# Altium schematic sheet E-11 SYS PWR.SchDoc: FRDM-IMX93
size 513 x 386 mm; DrawnBy: FORLINX; Organization: ORGANIZATION; Address1: ADDRESS 1; Address2: ADDRESS 2; Address3: ADDRESS 3; Address4: ADDRESS 4; Revision: -; ENG_APP_DATE: --/--/--; DSN_APP_DATE: --/--/--; CHK_APP_DATE: --/--/--; Classification: Public, Company Internal/Proprietary, Company Confidential,  Company Secret; Page Create Date: March  8, 1995; OrgName: NXP Semiconductor; FIUO: A; OrgAddr1: NO. 192 Liangjing Rd. Pudong New Area, ShangHai; Page Number: 11; PageTitle: SYS PWR; Page Size: C; Page Count: 23; Designer: FORLINX; RevCode: B1; Approver: NXP SE; Doc: SCH-94611 PDF: SPF-94611; DsnPath: T:\FILES\Designs\Single Board Computers\i.MX93-FRDM\Design Files\SCH-94611_B1.DSN; SchematicName: FRDM-i.MX 93 Development Board; PageName: E-11 SYS PWR; PageSize: C; TopSchematic: True
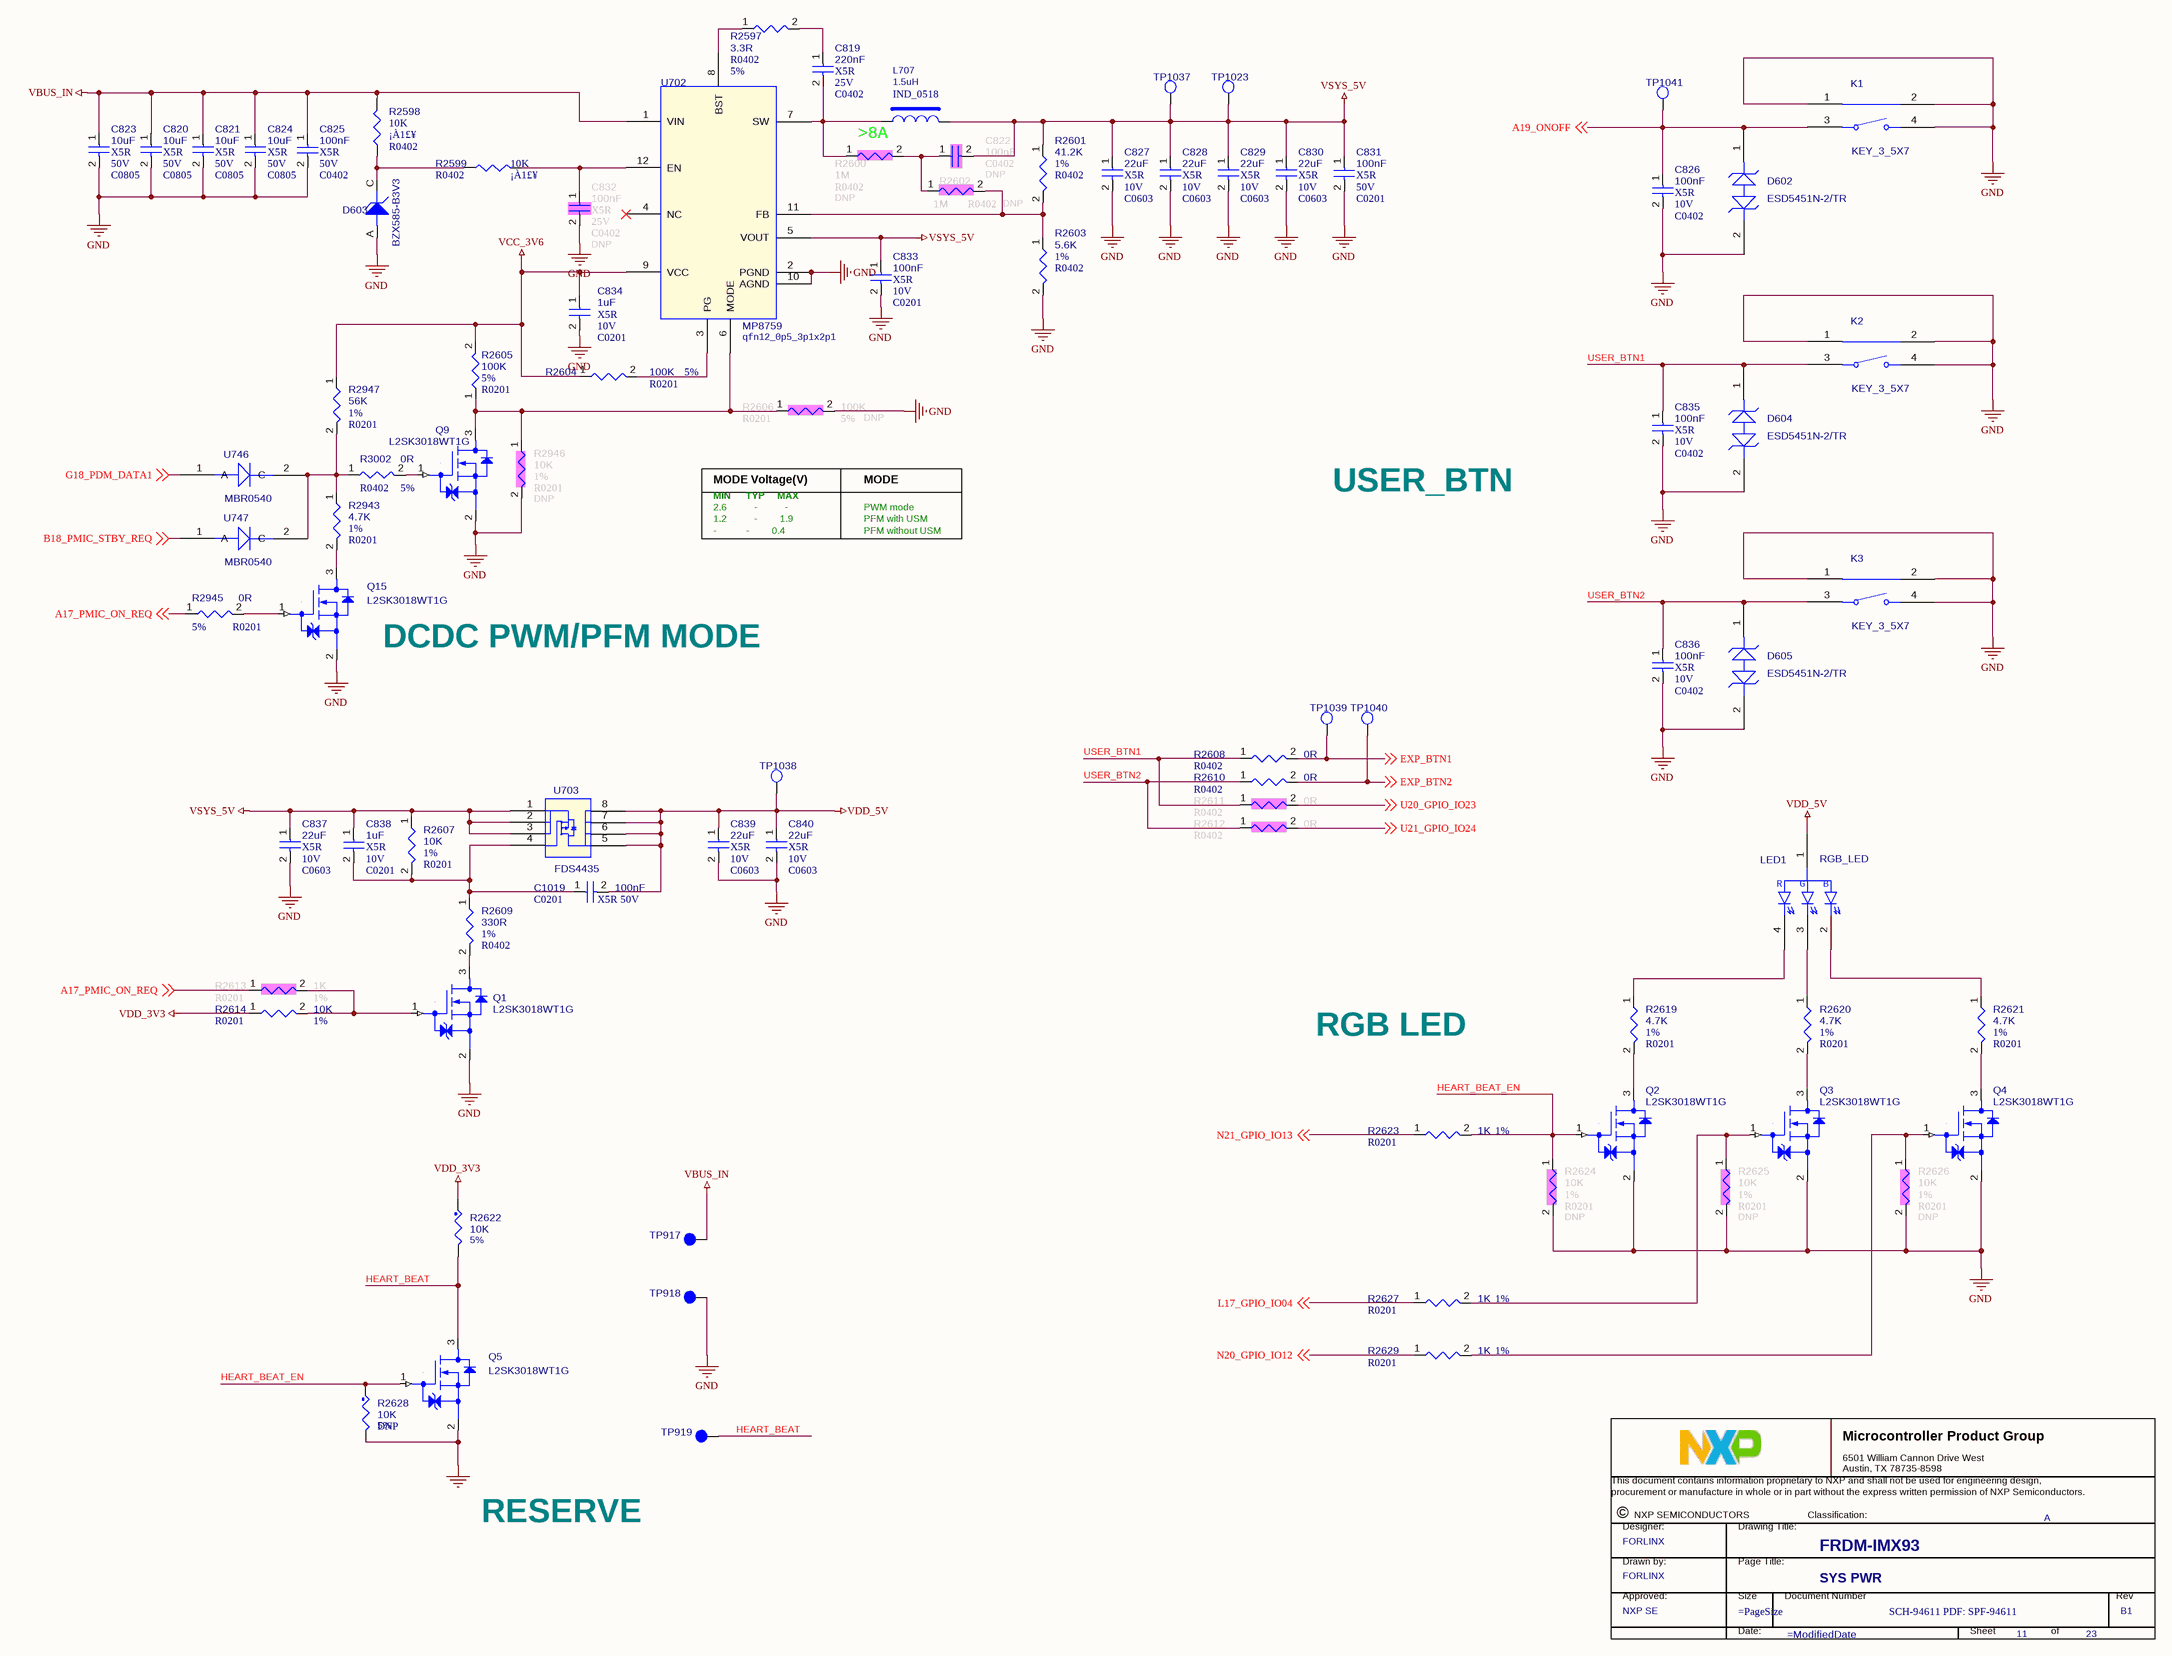
[diagram p0: E-11 SYS PWR.SchDoc]

## Parts
*  Title: FRDM-IMX93  RevCode: B1  PageTitle: SYS PWR  Page Number: 11  Page Count: 23  DrawnBy: FORLINX  Doc: SCH-94611 PDF: SPF-94611  Approver: NXP SE  FIUO: A  (graphical)
C819  220nF  Voltage: 25V  Dielectric: X5R  [C0402]
C820  10uF  Voltage: 50V  Dielectric: X5R  [C0805]
C821  10uF  Voltage: 50V  Dielectric: X5R  [C0805]
C822  100nF  ASSY_OPT: DNP  [C0402]
C823  10uF  Voltage: 50V  Dielectric: X5R  [C0805]
C824  10uF  Voltage: 50V  Dielectric: X5R  [C0805]
C825  100nF  Voltage: 50V  Dielectric: X5R  [C0402]
C826  100nF  Voltage: 10V  Dielectric: X5R  [C0402]
C827  22uF  Voltage: 10V  Dielectric: X5R  [C0603]
C828  22uF  Voltage: 10V  Dielectric: X5R  [C0603]
C829  22uF  Voltage: 10V  Dielectric: X5R  [C0603]
C830  22uF  Voltage: 10V  Dielectric: X5R  [C0603]
C831  100nF  Voltage: 50V  Dielectric: X5R  [C0201]
C832  100nF  Voltage: 25V  Dielectric: X5R  ASSY_OPT: DNP  [C0402]
C833  100nF  Voltage: 10V  Dielectric: X5R  [C0201]
C834  1uF  Voltage: 10V  Dielectric: X5R  [C0201]
C835  100nF  Voltage: 10V  Dielectric: X5R  [C0402]
C836  100nF  Voltage: 10V  Dielectric: X5R  [C0402]
C837  22uF  Voltage: 10V  Dielectric: X5R  [C0603]
C838  1uF  Voltage: 10V  Dielectric: X5R  [C0201]
C839  22uF  Voltage: 10V  Dielectric: X5R  [C0603]
C840  22uF  Voltage: 10V  Dielectric: X5R  [C0603]
C1019  100nF  Voltage: 50V  Dielectric: X5R  [C0201]
D602  ESD5451N-2/TR  [0402TVS]
D603  BZX585-B3V3  [sod523]
D604  ESD5451N-2/TR  [0402TVS]
D605  ESD5451N-2/TR  [0402TVS]
K1  KEY_3_5X7  [KEY_3_5X7]
K2  KEY_3_5X7  [KEY_3_5X7]
K3  KEY_3_5X7  [KEY_3_5X7]
L707  1.5uH  Option: >8A  [IND_0518]
LED1  RGB_LED  [smd_rgb_1_5x3]
Q1  L2SK3018WT1G  [sc70_3]
Q2  L2SK3018WT1G  [sc70_3]
Q3  L2SK3018WT1G  [sc70_3]
Q4  L2SK3018WT1G  [sc70_3]
Q5  L2SK3018WT1G  [sc70_3]
Q9  L2SK3018WT1G  [sc70_3]
Q15  L2SK3018WT1G  [sc70_3]
R2597  3.3R  Tolerance: 5%  [R0402]
R2598  10K  precision: ¡À1£¥  [R0402]
R2599  10K  precision: ¡À1£¥  [R0402]
R2600  1M  ASSY_OPT: DNP  [R0402]
R2601  41.2K  Tolerance: 1%  [R0402]
R2602  1M  ASSY_OPT: DNP  [R0402]
R2603  5.6K  Tolerance: 1%  [R0402]
R2604  100K  Tolerance: 5%  [R0201]
R2605  100K  Tolerance: 5%  [R0201]
R2606  100K  Tolerance: 5%  ASSY_OPT: DNP  [R0201]
R2607  10K  Tolerance: 1%  [R0201]
R2608  0R  [R0402]
R2609  330R  Tolerance: 1%  [R0402]
R2610  0R  [R0402]
R2611  0R  [R0402]
R2612  0R  [R0402]
R2613  1K  Tolerance: 1%  [R0201]
R2614  10K  Tolerance: 1%  [R0201]
R2619  4.7K  Tolerance: 1%  [R0201]
R2620  4.7K  Tolerance: 1%  [R0201]
R2621  4.7K  Tolerance: 1%  [R0201]
R2622  10K  Tolerance: 5%  [R0201]
R2623  1K  Tolerance: 1%  [R0201]
R2624  10K  Tolerance: 1%  ASSY_OPT: DNP  [R0201]
R2625  10K  Tolerance: 1%  ASSY_OPT: DNP  [R0201]
R2626  10K  Tolerance: 1%  ASSY_OPT: DNP  [R0201]
R2627  1K  Tolerance: 1%  [R0201]
R2628  10K  ASSY_OPT: DNP  Tolerance: 5%  [R0201]
R2629  1K  Tolerance: 1%  [R0201]
R2943  4.7K  Tolerance: 1%  [R0201]
R2945  0R  Tolerance: 5%  [R0201]
R2946  10K  Tolerance: 1%  ASSY_OPT: DNP  [R0201]
R2947  56K  Tolerance: 1%  [R0201]
R3002  0R  Tolerance: 5%  [R0402]
TP917  TPAD_1212  [tpad_1212]  (value not drawn)
TP918  TPAD_1212  [tpad_1212]  (value not drawn)
TP919  TPAD_1212  [tpad_1212]  (value not drawn)
TP1023  TPAD_020  [tpad_020]  (value not drawn)
TP1037  TPAD_020  [tpad_020]  (value not drawn)
TP1038  TPAD_020  [tpad_020]  (value not drawn)
TP1039  TPAD_020  [tpad_020]  (value not drawn)
TP1040  TPAD_020  [tpad_020]  (value not drawn)
TP1041  TPAD_020  [tpad_020]  (value not drawn)
U702  MP8759  [qfn12_0p5_3p1x2p1]
U703  FDS4435  [SOP8_1_27]
U746  MBR0540  [SOD_123]
U747  MBR0540  [SOD_123]

## Nets
GND: C820.2 C821.2 C823.2 C824.2 C825.2 C826.2 C827.2 C828.2 C829.2 C830.2 C831.2 C832.2 C833.2 C834.2 C835.2 C836.2 C837.2 C839.2 C840.2 D602.2 D603.A(ANODE) D604.2 D605.2 K1.1 K1.2 K1.4 K2.1 K2.2 K2.4 K3.1 K3.2 K3.4 Q1.2(SOURCE) Q2.2(SOURCE) Q3.2(SOURCE) Q4.2(SOURCE) Q5.2(SOURCE) Q9.2(SOURCE) Q15.2(SOURCE) R2603.2 R2606.2 R2624.2 R2625.2 R2626.2 R2628.2 R2946.2 TP918.1(Pin1) U702.2(PGND) U702.10(AGND)
VBUS_IN: C820.1 C821.1 C823.1 C824.1 C825.1 R2598.2 TP917.1(Pin1) U702.1(VIN)
VCC_3V6: C834.1 R2604.1 R2605.2 R2947.1 U702.9(VCC)
VDD_3V3: R2614.1 R2622.1
VDD_5V: C839.1 C840.1 C1019.2 LED1.1(+) TP1038.1(TP) U703.5(D4) U703.6(D3) U703.7(D2) U703.8(D1)
VSYS_5V: C822.2 C827.1 C828.1 C829.1 C830.1 C831.1 C833.1 C837.1 C838.1 L707.2 R2601.1 R2607.1 TP1023.1(TP) TP1037.1(TP) U702.5(VOUT) U703.1(S1) U703.2(S2) U703.3(S3)
A17_PMIC_ON_REQ: R2613.1 R2945.1 ; off-sheet A17_PMIC_ON_REQ
A19_ONOFF: C826.1 D602.1 K1.3 TP1041.1(TP) ; off-sheet A19_ONOFF
B18_PMIC_STBY_REQ: U747.1(A) ; off-sheet B18_PMIC_STBY_REQ
EXP_BTN1: R2608.2 TP1039.1(TP) ; off-sheet EXP_BTN1
EXP_BTN2: R2610.2 TP1040.1(TP) ; off-sheet EXP_BTN2
G18_PDM_DATA1: U746.1(A) ; off-sheet G18_PDM_DATA1
HEART_BEAT: Q5.3(DRAIN) R2622.2 TP919.1(Pin1)
HEART_BEAT_EN: Q2.1(GATE) Q5.1(GATE) R2623.2 R2624.1 R2628.1
L17_GPIO_IO04: R2627.1 ; off-sheet L17_GPIO_IO04
N20_GPIO_IO12: R2629.1 ; off-sheet N20_GPIO_IO12
N21_GPIO_IO13: R2623.1 ; off-sheet N21_GPIO_IO13
U20_GPIO_IO23: R2611.2 ; off-sheet U20_GPIO_IO23
U21_GPIO_IO24: R2612.2 ; off-sheet U21_GPIO_IO24
USER_BTN1: C835.1 D604.1 K2.3 R2608.1 R2611.1
USER_BTN2: C836.1 D605.1 K3.3 R2610.1 R2612.1
NetC819_1: C819.1 R2597.2
NetC819_2: C819.2 L707.1 R2600.1 U702.7(SW)
NetC822_1: C822.1 R2600.2 R2602.1
NetC832_1: C832.1 R2599.2 U702.12(EN)
NetC838_2: C838.2 C1019.1 R2607.2 R2609.1 U703.4(G)
NetD603_C: D603.C(CATHODE) R2598.1 R2599.1
NetLED1_2: LED1.2(B) R2621.1
NetLED1_3: LED1.3(G) R2620.1
NetLED1_4: LED1.4(R) R2619.1
NetQ1_1: Q1.1(GATE) R2613.2 R2614.2
NetQ1_3: Q1.3(DRAIN) R2609.2
NetQ2_3: Q2.3(DRAIN) R2619.2
NetQ3_1: Q3.1(GATE) R2625.1 R2627.2
NetQ3_3: Q3.3(DRAIN) R2620.2
NetQ4_1: Q4.1(GATE) R2626.1 R2629.2
NetQ4_3: Q4.3(DRAIN) R2621.2
NetQ9_1: Q9.1(GATE) R3002.2
NetQ9_3: Q9.3(DRAIN) R2605.1 R2606.1 R2946.1 U702.6(MODE)
NetQ15_1: Q15.1(GATE) R2945.2
NetQ15_3: Q15.3(DRAIN) R2943.2
NetR2597_1: R2597.1 U702.8(BST)
NetR2601_2: R2601.2 R2602.2 R2603.1 U702.11(FB)
NetR2604_2: R2604.2 U702.3(PG)
NetR2943_1: R2943.1 R2947.2 R3002.1 U746.2(C) U747.2(C)

Not connected (* = marked no-connect by the designer): U702 4(NC)*

## Notes on the sheet
- 2.6           -           -
- MIN      TYP     MAX
- MODE Voltage(V)
- PWM mode
- MODE
- USER_BTN
- -            -         0.4
- 1.2           -         1.9
- PFM without USM
- PFM with USM
- DCDC PWM/PFM MODE
- RGB LED
- RESERVE
- DWG. NO.
- REV.
- SHT.
- REVISION
- DESCRIPTION
- DATE
- APPROVED
- ENG:
- APPROVALS
- quilter.ai <http://quilter.ai>
- DSN:
- CHK:
- REFERENCE DOCUMENTS
- TITLE
- PROJECT
- BOM:
- FAB DWG:
- PCB DWG:
- ASSY DWG:
- SIZE
- FILE NAME
- C
- DWG NO.
- SHEET
- OF
- REV
- (in symbol TitleBlock_MCPG) Microcontroller Product Group; 6501 William Cannon Drive West / Austin, TX 78735-8598; This document contains information proprietary to NXP and shall not be used for engineering design,; procurement or manufacture in whole or in part without the express written permission of NXP Semiconductors.; ©; NXP SEMICONDUCTORS; Classification:; Designer:; Drawing Title:; Drawn by:; Page Title:; Approved:; Size; Document Number; Rev; Date:; Sheet; of

## Library data of the parts
* = TitleBlock_MCPG: Classification: Public, Company Internal/Proprietary, Company Confidential,  Company Secret; OrgAddr1: NO. 192 Liangjing Rd. Pudong New Area, ShangHai; OrgName: NXP Semiconductor; Page Size: =PageSize; Page Create Date: March  8, 1995; Designer: FORLINX; Page Modify Date: =ModifiedDate
C819 = CAP NP: 0402,220nF,25V,+/-10%,X5R; Part Reference: C819; Manufacturer PN: C1005X5R1E224K050BC; Manufacturer: TDK; MFG_NAME01: SAMSUNG; C_Voltage: 6.3V; Tolerance: 10%; Priority: A; Number: 37; MFG_PN01: CL05A224KA5NNNC; PCB Footprint: C0402; Value: 220nF; Created by: JJJ; Part Type: C0402; RK PN: C1005X5R1E224K050BC
C820 = CAP NP: 0805,10uF,50V,+/-10%,X5R; Part Reference: C820; Manufacturer PN: C2012X5R1A226K125AB; Manufacturer: TDK; MFG_NAME01: SAMSUNG; Tolerance: 10%; C_Voltage: 6.3V; Priority: A; MFG_PN01: CL21A106KBYQNNE; PCB Footprint: C0805; Value: 10uF; Created by: JJJ; Part Type: C0805; RK PN: C2012X5R1A226K125AB
C821 = CAP NP: 0805,10uF,50V,+/-10%,X5R; Part Reference: C821; Manufacturer: TDK; MFG_NAME01: SAMSUNG; RK PN: C2012X5R1A226K125AB; Priority: A; C_Voltage: 6.3V; Tolerance: 10%; MFG_PN01: CL21A106KBYQNNE; PCB Footprint: C0805; Value: 10uF; Part Type: C0805; Manufacturer PN: C2012X5R1A226K125AB; Created by: JJJ
C822 = CAP NP: 0402,100nF,50V,+/-10%,X5R; Part Reference: C822; MFG_PN01: 0402X104K500NT; Number: 37; RK PN: DNPC0402; Priority: A; C_Voltage: 6.3V; MFG_NAME01: FENGHUA; PCB Footprint: C0402; Value: 100nF; Part Type: DNP; Manufacturer PN: DNPC0402; Created by: JJJ
C823 = CAP NP: 0805,10uF,50V,+/-10%,X5R; Part Reference: C823; Manufacturer PN: C2012X5R1A226K125AB; Manufacturer: TDK; MFG_NAME01: SAMSUNG; Tolerance: 10%; C_Voltage: 6.3V; Priority: A; MFG_PN01: CL21A106KBYQNNE; PCB Footprint: C0805; Value: 10uF; Created by: JJJ; Part Type: C0805; RK PN: C2012X5R1A226K125AB
C824 = CAP NP: 0805,10uF,50V,+/-10%,X5R; Part Reference: C824; Manufacturer: TDK; MFG_NAME01: SAMSUNG; RK PN: C2012X5R1A226K125AB; Priority: A; C_Voltage: 6.3V; Tolerance: 10%; MFG_PN01: CL21A106KBYQNNE; PCB Footprint: C0805; Value: 10uF; Part Type: C0805; Manufacturer PN: C2012X5R1A226K125AB; Created by: JJJ
C825 = CAP NP: 0402,100nF,50V,+/-10%,X5R; Part Reference: C825; Manufacturer: TDK; MFG_NAME01: FENGHUA; Number: 37; RK PN: C1005X5R1A104K050BA; Priority: A; Tolerance: 10%; C_Voltage: 6.3V; MFG_PN01: 0402X104K500NT; PCB Footprint: C0402; Value: 100nF; Part Type: C0402; Manufacturer PN: C1005X5R1A104K050BA; Created by: JJJ
C826 = CAP NP: 0402,100nF,50V,+/-10%,X5R; Part Reference: C826; Manufacturer: TDK; MFG_NAME01: FENGHUA; Number: 37; RK PN: C1005X5R1A104K050BA; Priority: A; Tolerance: 10%; C_Voltage: 6.3V; MFG_PN01: 0402X104K500NT; PCB Footprint: C0402; Value: 100nF; Part Type: C0402; Manufacturer PN: C1005X5R1A104K050BA; Created by: JJJ
C827 = CAP NP: 0603,22uF,6.3V,+/-20%,X5R; Part Reference: C827; Manufacturer PN: C2012X5R1A226K125AB; Manufacturer: TDK; MFG_NAME01: SAMSUNG; Tolerance: 10%; Priority: A; MFG_PN01: CL10A226MQ8NRNC; PCB Footprint: C0603; Value: 22uF; Created by: JJJ; C_Voltage: 6.3V; Part Type: C0805; RK PN: C2012X5R1A226K125AB
C828 = CAP NP: 0603,22uF,6.3V,+/-20%,X5R; Part Reference: C828; Manufacturer PN: C2012X5R1A226K125AB; Manufacturer: TDK; MFG_NAME01: SAMSUNG; Tolerance: 10%; Priority: A; MFG_PN01: CL10A226MQ8NRNC; PCB Footprint: C0603; Value: 22uF; Created by: JJJ; C_Voltage: 6.3V; Part Type: C0805; RK PN: C2012X5R1A226K125AB
C829 = CAP NP: 0603,22uF,6.3V,+/-20%,X5R; Part Reference: C829; Manufacturer: TDK; MFG_NAME01: SAMSUNG; RK PN: C2012X5R1A226K125AB; Priority: A; Tolerance: 10%; MFG_PN01: CL10A226MQ8NRNC; PCB Footprint: C0603; Value: 22uF; Part Type: C0805; C_Voltage: 6.3V; Manufacturer PN: C2012X5R1A226K125AB; Created by: JJJ
C830 = CAP NP: 0603,22uF,6.3V,+/-20%,X5R; Part Reference: C830; Manufacturer: TDK; MFG_NAME01: SAMSUNG; RK PN: C2012X5R1A226K125AB; Priority: A; Tolerance: 10%; MFG_PN01: CL10A226MQ8NRNC; PCB Footprint: C0603; Value: 22uF; Part Type: C0805; C_Voltage: 6.3V; Manufacturer PN: C2012X5R1A226K125AB; Created by: JJJ
C831 = CAP NP: 0201,100nF,25V,+/-10%,X5R; Part Reference: C831; Manufacturer: TDK; MFG_NAME01: FENGHUA; Number: 37; RK PN: C1005X5R1A104K050BA; Priority: A; Tolerance: 10%; C_Voltage: 6.3V; MFG_PN01: 0201X104K250NT; PCB Footprint: C0201; Value: 100nF; Part Type: C0402; Manufacturer PN: C1005X5R1A104K050BA; Created by: JJJ
C832 = CAP NP: 0402,100nF,50V,+/-10%,X5R; Part Reference: C832; Manufacturer PN: C1005X5R1E104K050BC; Manufacturer: TDK; MFG_NAME01: FENGHUA; C_Voltage: 6.3V; Tolerance: 10%; Priority: A; Number: 37; MFG_PN01: 0402X104K500NT; PCB Footprint: C0402; Value: 100nF; Created by: JJJ; Part Type: C0402; RK PN: C1005X5R1E104K050BC; Option: DNP
C833 = CAP NP: 0201,100nF,25V,+/-10%,X5R; Part Reference: C833; Manufacturer: TDK; MFG_NAME01: FENGHUA; Number: 37; RK PN: C1005X5R1A104K050BA; Priority: A; Tolerance: 10%; C_Voltage: 6.3V; MFG_PN01: 0201X104K250NT; PCB Footprint: C0201; Value: 100nF; Part Type: C0402; Manufacturer PN: C1005X5R1A104K050BA; Created by: JJJ
C834 = CAP NP: 0201,1uF,10V,+/-20%,X5R; Part Reference: C834; Manufacturer PN: C1005X5R1A105K050BB; Manufacturer: TDK; MFG_NAME01: SAMSUNG; C_Voltage: 6.3V; Tolerance: 10%; Priority: A; Number: 37; MFG_PN01: CL03A105MP3NSNC; PCB Footprint: C0201; Value: 1uF; Created by: JJJ; Part Type: C0402; RK PN: C1005X5R1A105K050BB
C835 = CAP NP: 0402,100nF,50V,+/-10%,X5R; Part Reference: C835; Manufacturer PN: C1005X5R1A104K050BA; Manufacturer: TDK; MFG_NAME01: FENGHUA; C_Voltage: 6.3V; Tolerance: 10%; Priority: A; Number: 37; MFG_PN01: 0402X104K500NT; PCB Footprint: C0402; Value: 100nF; Created by: JJJ; Part Type: C0402; RK PN: C1005X5R1A104K050BA
C836 = CAP NP: 0402,100nF,50V,+/-10%,X5R; Part Reference: C836; Manufacturer PN: C1005X5R1A104K050BA; Manufacturer: TDK; MFG_NAME01: FENGHUA; C_Voltage: 6.3V; Tolerance: 10%; Priority: A; Number: 37; MFG_PN01: 0402X104K500NT; PCB Footprint: C0402; Value: 100nF; Created by: JJJ; Part Type: C0402; RK PN: C1005X5R1A104K050BA
C837 = CAP NP: 0603,22uF,6.3V,+/-20%,X5R; Part Reference: C837; Manufacturer: TDK; MFG_NAME01: SAMSUNG; RK PN: C2012X5R1A226K125AB; Priority: A; Tolerance: 10%; MFG_PN01: CL10A226MQ8NRNC; PCB Footprint: C0603; Value: 22uF; Part Type: C0805; C_Voltage: 6.3V; Manufacturer PN: C2012X5R1A226K125AB; Created by: JJJ
C838 = CAP NP: 0201,1uF,10V,+/-20%,X5R; Part Reference: C838; Manufacturer PN: C1005X5R1A104K050BA; Manufacturer: TDK; MFG_NAME01: SAMSUNG; C_Voltage: 6.3V; Tolerance: 10%; Priority: A; Number: 37; MFG_PN01: CL03A105MP3NSNC; PCB Footprint: C0201; Value: 1uF; Created by: JJJ; Part Type: C0402; RK PN: C1005X5R1A104K050BA
C839 = CAP NP: 0603,22uF,6.3V,+/-20%,X5R; Part Reference: C839; Manufacturer PN: C2012X5R1A226K125AB; Manufacturer: TDK; MFG_NAME01: SAMSUNG; Tolerance: 10%; Priority: A; MFG_PN01: CL10A226MQ8NRNC; PCB Footprint: C0603; Value: 22uF; Created by: JJJ; C_Voltage: 6.3V; Part Type: C0805; RK PN: C2012X5R1A226K125AB
C840 = CAP NP: 0603,22uF,6.3V,+/-20%,X5R; Part Reference: C840; Manufacturer: TDK; MFG_NAME01: SAMSUNG; RK PN: C2012X5R1A226K125AB; Priority: A; Tolerance: 10%; MFG_PN01: CL10A226MQ8NRNC; PCB Footprint: C0603; Value: 22uF; Part Type: C0805; C_Voltage: 6.3V; Manufacturer PN: C2012X5R1A226K125AB; Created by: JJJ
C1019 = CAP NP: 0201,100nF,25V,+/-10%,X5R; Part Reference: C1019; Manufacturer: TDK; MFG_NAME01: FENGHUA; Number: 37; RK PN: C1005X5R1A104K050BA; Priority: A; Tolerance: 10%; C_Voltage: 6.3V; MFG_PN01: 0201X104K250NT; PCB Footprint: C0201; Value: 100nF; Part Type: C0402; Manufacturer PN: C1005X5R1A104K050BA; Created by: JJJ
D602 = ESD5451N-2/TR: Part Reference: D602; MFG_NAME01: WILLSEMI; Value: ESD5451N-2/TR; MFG_PN01: ESD5451N-2/TR; PCB Footprint: 0402TVS
D603 = ZDIODE: BZX585-B3V3,3.3V,SOD523; Part Reference: D603; CLASS: IC; Temp Range: -65¡ãC to +150¡ãC; CAD_APPROVED: Yes; MFG_NAME01: JSCJ; Value: BZX585-B3V3; HEIGHT: 0.65MM; Temp_Range: -65¡ãC to +150¡ãC; ROHS: Yes; MFG_PN01: BZX585-B3V3; PCB Footprint: sod523
D604 = ESD5451N-2/TR: Part Reference: D604; MFG_NAME01: WILLSEMI; Value: ESD5451N-2/TR; MFG_PN01: ESD5451N-2/TR; PCB Footprint: 0402TVS
D605 = ESD5451N-2/TR: Part Reference: D605; MFG_NAME01: WILLSEMI; Value: ESD5451N-2/TR; MFG_PN01: ESD5451N-2/TR; PCB Footprint: 0402TVS
K1 = 1188E_1K: 3x6mm,KEY; Part Reference: K1; MFG_NAME01: HONGSHENGLONG; MFG_PN01: KEY-3x6mm; Value: KEY_3_5X7; PCB Footprint: KEY_3_5X7
K2 = 1188E_1K: 3x6mm,KEY; Part Reference: K2; MFG_NAME01: HONGSHENGLONG; MFG_PN01: KEY-3x6mm; Value: KEY_3_5X7; PCB Footprint: KEY_3_5X7
K3 = 1188E_1K: 3x6mm,KEY; Part Reference: K3; MFG_NAME01: HONGSHENGLONG; MFG_PN01: KEY-3x6mm; Value: KEY_3_5X7; PCB Footprint: KEY_3_5X7
L707 = INDUCTORS OF FERRITE: 1.5uH+/-20%,5.2*5.4*1.6,7.5A/8A; Part Reference: L707; Manufacturer: Vishay; Isat: 9.6A; MFG_NAME01: Sunlord; Priority: A; Tolerance: 20%; Irms: 10.5A; MFG_PN01: MWSA0518S-1R5MT; PCB Footprint: IND_0518; Value: 1.5uH; Part Type: IND; Created by: JJJ
LED1 = RGB_LED: SMD,1.5*3mm,Tri color LED, common anode, side mount, colorless transparent lens,12-23C/R6GHBHC-C30/2C; Part Reference: LED1; MFG_NAME01: EVERLIGHT; Value: RGB_LED; MFG_PN01: 12-23C/R6GHBHC-C30/2C; PCB Footprint: smd_rgb_1_5x3
Q1 = NX3008NBKW_SOT323: Part Reference: Q1; CLASS: IC; MFG_NAME01: LRC; CAD_APPROVED: Yes; Value: L2SK3018WT1G; MFG_PN01: L2SK3018WT1G; ROHS: Yes; HEIGHT: 1.1MM; PCB Footprint: sc70_3
Q2 = NX3008NBKW_SOT323: Part Reference: Q2; CLASS: IC; CAD_APPROVED: Yes; MFG_NAME01: LRC; Value: L2SK3018WT1G; HEIGHT: 1.1MM; ROHS: Yes; MFG_PN01: L2SK3018WT1G; PCB Footprint: sc70_3
Q3 = NX3008NBKW_SOT323: Part Reference: Q3; CLASS: IC; MFG_NAME01: LRC; CAD_APPROVED: Yes; Value: L2SK3018WT1G; MFG_PN01: L2SK3018WT1G; ROHS: Yes; HEIGHT: 1.1MM; PCB Footprint: sc70_3
Q4 = NX3008NBKW_SOT323: Part Reference: Q4; CLASS: IC; MFG_NAME01: LRC; CAD_APPROVED: Yes; Value: L2SK3018WT1G; MFG_PN01: L2SK3018WT1G; ROHS: Yes; HEIGHT: 1.1MM; PCB Footprint: sc70_3
Q5 = NX3008NBKW_SOT323: Part Reference: Q5; CLASS: IC; MFG_NAME01: LRC; CAD_APPROVED: Yes; Value: L2SK3018WT1G; MFG_PN01: L2SK3018WT1G; ROHS: Yes; HEIGHT: 1.1MM; PCB Footprint: sc70_3
Q9 = NX3008NBKW_SOT323: Part Reference: Q9; CLASS: IC; CAD_APPROVED: Yes; MFG_NAME01: LRC; Value: L2SK3018WT1G; HEIGHT: 1.1MM; ROHS: Yes; MFG_PN01: L2SK3018WT1G; PCB Footprint: sc70_3
Q15 = NX3008NBKW_SOT323: Part Reference: Q15; CLASS: IC; CAD_APPROVED: Yes; MFG_NAME01: LRC; Value: L2SK3018WT1G; HEIGHT: 1.1MM; ROHS: Yes; MFG_PN01: L2SK3018WT1G; PCB Footprint: sc70_3
R2597 = RESISTOR: 0402,3.3Ohm,+/-1%; Part Reference: R2597; Manufacturer PN: RC0402JR-073R3L; Manufacturer: YAGEO; MFG_NAME01: FENGHUA; Wattage: 1/16W; Priority: A; MFG_PN01: RC-02U3R30FT; PCB Footprint: R0402; Value: 3.3R; Created by: YTL; Part Type: Í¨ÓÃºñÄ¤µç×è; RK PN: RC0402JR-073R3L
R2598 = R0402,4.7K: 0402,10K,+/-1%; Part Reference: R2598; serial number: 1110102015; MFG_NAME01: FENGHUA; MFG_PN01: RC-02W1002FT; PCB Footprint: R0402; Value: 10K
R2599 = R0402,4.7K: 0402,10K,+/-1%; Part Reference: R2599; serial number: 1110102015; MFG_NAME01: FENGHUA; MFG_PN01: RC-02W1002FT; PCB Footprint: R0402; Value: 10K
R2600 = RESISTOR: 0402,1M,+/-1%; Part Reference: R2600; MFG_PN01: RC-02K1004FT; RK PN: DNPR0402; Priority: A; MFG_NAME01: FENGHUA; PCB Footprint: R0402; Value: 1M; Part Type: DNP; Manufacturer PN: DNPR0402; Created by: JJJ
R2601 = RESISTOR: 0402,41.2K,+/-1%; Part Reference: R2601; Manufacturer PN: RC0402FR-0743KL; Manufacturer: YAGEO; MFG_NAME01: FENGHUA; Wattage: 1/16W; Priority: A; MFG_PN01: RC-02W4122FT; PCB Footprint: R0402; Value: 41.2K; Created by: YTL; Part Type: Í¨ÓÃºñÄ¤µç×è; RK PN: RC0402FR-0743KL
R2602 = RESISTOR: 0402,1M,+/-1%; Part Reference: R2602; Manufacturer PN: DNPR0402; MFG_PN01: RC-02K1004FT; Priority: A; MFG_NAME01: FENGHUA; PCB Footprint: R0402; Value: 1M; Created by: JJJ; Part Type: DNP; RK PN: DNPR0402
R2603 = RESISTOR: 0402,5.6K,+/-1%; Part Reference: R2603; Manufacturer: YAGEO; MFG_NAME01: FENGHUA; RK PN: RC0402FR-077K5L; Priority: A; Wattage: 1/16W; MFG_PN01: RC-02W5601FT; PCB Footprint: R0402; Value: 5.6K; Part Type: Í¨ÓÃºñÄ¤µç×è; Manufacturer PN: RC0402FR-077K5L; Created by: YTL
R2604 = RESISTOR: 0201,100K,+/-1%; Part Reference: R2604; Manufacturer: YAGEO; MFG_NAME01: FENGHUA; RK PN: RC0402JR-07100KL; Priority: A; Wattage: 1/16W; MFG_PN01: RC-01W1003FT; PCB Footprint: R0201; Value: 100K; Part Type: Í¨ÓÃºñÄ¤µç×è; Manufacturer PN: RC0402JR-07100KL; Created by: YTL
R2605 = RESISTOR: 0201,100K,+/-1%; Part Reference: R2605; Manufacturer PN: RC0402JR-07100KL; Manufacturer: YAGEO; MFG_NAME01: FENGHUA; Wattage: 1/16W; Priority: A; MFG_PN01: RC-01W1003FT; PCB Footprint: R0201; Value: 100K; Created by: YTL; Part Type: Í¨ÓÃºñÄ¤µç×è; RK PN: RC0402JR-07100KL
R2606 = RESISTOR: 0201,100K,+/-1%; Part Reference: R2606; Manufacturer: YAGEO; MFG_NAME01: FENGHUA; RK PN: RC0402JR-07100KL; Priority: A; Wattage: 1/16W; MFG_PN01: RC-01W1003FT; PCB Footprint: R0201; Value: 100K; Option: DNP; Part Type: Í¨ÓÃºñÄ¤µç×è; Manufacturer PN: RC0402JR-07100KL; Created by: YTL
R2607 = RESISTOR: 0201,10K,+/-5%; Part Reference: R2607; Manufacturer PN: RC0402FR-0743KL; Manufacturer: YAGEO; MFG_NAME01: FENGHUA; Wattage: 1/16W; Priority: A; MFG_PN01: RC-01W103JT; PCB Footprint: R0201; Value: 10K; Created by: YTL; Part Type: Í¨ÓÃºñÄ¤µç×è; RK PN: RC0402FR-0743KL
R2608 = RESISTOR: 0402,0Ohm,+/-1%; Part Reference: R2608; Manufacturer: YAGEO; Tolerance: 1%; MFG_NAME01: FENGHUA; RK PN: RC0402FR-0743KL; Priority: A; Wattage: 1/16W; MFG_PN01: RC-02000FT; PCB Footprint: R0402; Value: 0R; Part Type: Í¨ÓÃºñÄ¤µç×è; Manufacturer PN: RC0402FR-0743KL; Created by: YTL
R2609 = RESISTOR: 0402,330Ohm,+/-1%; Part Reference: R2609; Manufacturer PN: RC0402FR-0743KL; Manufacturer: YAGEO; MFG_NAME01: FENGHUA; Wattage: 1/16W; Priority: A; MFG_PN01: RC-02W3300FT; PCB Footprint: R0402; Value: 330R; Created by: YTL; Part Type: Í¨ÓÃºñÄ¤µç×è; RK PN: RC0402FR-0743KL
R2610 = RESISTOR: 0402,0Ohm,+/-1%; Part Reference: R2610; Manufacturer: YAGEO; Tolerance: 1%; MFG_NAME01: FENGHUA; RK PN: RC0402FR-0743KL; Priority: A; Wattage: 1/16W; MFG_PN01: RC-02000FT; PCB Footprint: R0402; Value: 0R; Part Type: Í¨ÓÃºñÄ¤µç×è; Manufacturer PN: RC0402FR-0743KL; Created by: YTL
R2611 = RESISTOR: 0402,0Ohm,+/-1%; Part Reference: R2611; Manufacturer PN: RC0402FR-0743KL; Manufacturer: YAGEO; Tolerance: 1%; MFG_NAME01: FENGHUA; ASSY_OPT: DNP; Wattage: 1/16W; Priority: A; MFG_PN01: RC-02000FT; PCB Footprint: R0402; Value: 0R; Created by: YTL; Part Type: Í¨ÓÃºñÄ¤µç×è; RK PN: RC0402FR-0743KL
R2612 = RESISTOR: 0402,0Ohm,+/-1%; Part Reference: R2612; Manufacturer PN: RC0402FR-0743KL; Manufacturer: YAGEO; Tolerance: 1%; MFG_NAME01: FENGHUA; ASSY_OPT: DNP; Wattage: 1/16W; Priority: A; MFG_PN01: RC-02000FT; PCB Footprint: R0402; Value: 0R; Created by: YTL; Part Type: Í¨ÓÃºñÄ¤µç×è; RK PN: RC0402FR-0743KL
R2613 = RESISTOR: 0201,1K,+/-1%; Part Reference: R2613; Manufacturer: YAGEO; MFG_NAME01: FENGHUA; ASSY_OPT: DNP; RK PN: RC0402FR-0743KL; Priority: A; Wattage: 1/16W; MFG_PN01: RC-01W1001FT; PCB Footprint: R0201; Value: 1K; Part Type: Í¨ÓÃºñÄ¤µç×è; Manufacturer PN: RC0402FR-0743KL; Created by: YTL
R2614 = RESISTOR: 0201,10K,+/-5%; Part Reference: R2614; Manufacturer: YAGEO; MFG_NAME01: FENGHUA; RK PN: RC0402FR-0743KL; Priority: A; Wattage: 1/16W; MFG_PN01: RC-01W103JT; PCB Footprint: R0201; Value: 10K; Part Type: Í¨ÓÃºñÄ¤µç×è; Manufacturer PN: RC0402FR-0743KL; Created by: YTL
R2619 = RESISTOR: 0201,4.7K,+/-1%; Part Reference: R2619; Manufacturer PN: RC0402FR-0743KL; Manufacturer: YAGEO; MFG_NAME01: FENGHUA; Wattage: 1/16W; Priority: A; MFG_PN01: RC-01W4701FT; PCB Footprint: R0201; Value: 4.7K; Created by: YTL; Part Type: Í¨ÓÃºñÄ¤µç×è; RK PN: RC0402FR-0743KL
R2620 = RESISTOR: 0201,4.7K,+/-1%; Part Reference: R2620; Manufacturer: YAGEO; MFG_NAME01: FENGHUA; RK PN: RC0402FR-0743KL; Priority: A; Wattage: 1/16W; MFG_PN01: RC-01W4701FT; PCB Footprint: R0201; Value: 4.7K; Part Type: Í¨ÓÃºñÄ¤µç×è; Manufacturer PN: RC0402FR-0743KL; Created by: YTL
R2621 = RESISTOR: 0201,4.7K,+/-1%; Part Reference: R2621; Manufacturer: YAGEO; MFG_NAME01: FENGHUA; RK PN: RC0402FR-0743KL; Priority: A; Wattage: 1/16W; MFG_PN01: RC-01W4701FT; PCB Footprint: R0201; Value: 4.7K; Part Type: Í¨ÓÃºñÄ¤µç×è; Manufacturer PN: RC0402FR-0743KL; Created by: YTL
R2622 = RES: 0201,10K,+/-5%; Part Reference: R2622; CLASS: DISCRETE; MFG_NAME01: FENGHUA; MFG_PN01: RC-01W103JT; CAD_APPROVED: Yes; FPLIST: RC0402_25,RC0402_HD,0402_CC; Value: 10K; ROHS: Yes; HEIGHT: 0.4 MM; PCB Footprint: R0201
R2623 = RESISTOR: 0201,1K,+/-1%; Part Reference: R2623; Manufacturer: YAGEO; MFG_NAME01: FENGHUA; RK PN: RC0402FR-0743KL; Priority: A; Wattage: 1/16W; MFG_PN01: RC-01W1001FT; PCB Footprint: R0201; Value: 1K; Part Type: Í¨ÓÃºñÄ¤µç×è; Manufacturer PN: RC0402FR-0743KL; Created by: YTL
R2624 = RESISTOR: 0201,10K,+/-5%; Part Reference: R2624; Manufacturer PN: RC0402FR-0743KL; Manufacturer: YAGEO; MFG_NAME01: FENGHUA; Wattage: 1/16W; Priority: A; MFG_PN01: RC-01W103JT; PCB Footprint: R0201; Value: 10K; Created by: YTL; Part Type: Í¨ÓÃºñÄ¤µç×è; RK PN: RC0402FR-0743KL
R2625 = RESISTOR: 0201,10K,+/-5%; Part Reference: R2625; Manufacturer PN: RC0402FR-0743KL; Manufacturer: YAGEO; MFG_PN01: RC-01W103JT; Wattage: 1/16W; Priority: A; MFG_NAME01: FENGHUA; PCB Footprint: R0201; Value: 10K; Created by: YTL; Part Type: Í¨ÓÃºñÄ¤µç×è; RK PN: RC0402FR-0743KL
R2626 = RESISTOR: 0201,10K,+/-5%; Part Reference: R2626; Manufacturer PN: RC0402FR-0743KL; Manufacturer: YAGEO; MFG_PN01: RC-01W103JT; Wattage: 1/16W; Priority: A; MFG_NAME01: FENGHUA; PCB Footprint: R0201; Value: 10K; Created by: YTL; Part Type: Í¨ÓÃºñÄ¤µç×è; RK PN: RC0402FR-0743KL
R2627 = RESISTOR: 0201,1K,+/-1%; Part Reference: R2627; Manufacturer: YAGEO; MFG_NAME01: FENGHUA; RK PN: RC0402FR-0743KL; Priority: A; Wattage: 1/16W; MFG_PN01: RC-01W1001FT; PCB Footprint: R0201; Value: 1K; Part Type: Í¨ÓÃºñÄ¤µç×è; Manufacturer PN: RC0402FR-0743KL; Created by: YTL
R2628 = RES: 0201,10K,+/-5%; Part Reference: R2628; CLASS: DISCRETE; MFG_NAME01: FENGHUA; MFG_PN01: RC-01W103JT; CAD_APPROVED: Yes; FPLIST: RC0402_25,RC0402_HD,0402_CC; Value: 10K; ROHS: Yes; HEIGHT: 0.4 MM; PCB Footprint: R0201
R2629 = RESISTOR: 0201,1K,+/-1%; Part Reference: R2629; Manufacturer: YAGEO; MFG_NAME01: FENGHUA; RK PN: RC0402FR-0743KL; Priority: A; Wattage: 1/16W; MFG_PN01: RC-01W1001FT; PCB Footprint: R0201; Value: 1K; Part Type: Í¨ÓÃºñÄ¤µç×è; Manufacturer PN: RC0402FR-0743KL; Created by: YTL
R2943 = RESISTOR: 0201,4.7K,+/-1%; Part Reference: R2943; Manufacturer: YAGEO; MFG_NAME01: FENGHUA; RK PN: RC0402FR-0743KL; Priority: A; Wattage: 1/16W; MFG_PN01: RC-01W4701FT; PCB Footprint: R0201; Value: 4.7K; Part Type: Í¨ÓÃºñÄ¤µç×è; Manufacturer PN: RC0402FR-0743KL; Created by: YTL
R2945 = RESISTOR: 0201,0Ohm,+/-5%; Part Reference: R2945; Manufacturer: YAGEO; MFG_NAME01: FENGHUA; RK PN: RC0402JR-07100KL; Priority: A; Wattage: 1/16W; MFG_PN01: RC-01000JT; PCB Footprint: R0201; Value: 0R; Part Type: Í¨ÓÃºñÄ¤µç×è; Manufacturer PN: RC0402JR-07100KL; Created by: YTL
R2946 = RESISTOR: 0201,10K,+/-5%; Part Reference: R2946; Manufacturer: YAGEO; MFG_NAME01: FENGHUA; RK PN: RC0402FR-0743KL; Priority: A; Wattage: 1/16W; MFG_PN01: RC-01W103JT; PCB Footprint: R0201; Value: 10K; Part Type: Í¨ÓÃºñÄ¤µç×è; Manufacturer PN: RC0402FR-0743KL; Created by: YTL
R2947 = RESISTOR: 0201,56K,+/-1%; Part Reference: R2947; Manufacturer: YAGEO; MFG_NAME01: FENGHUA; RK PN: RC0402FR-0743KL; Priority: A; Wattage: 1/16W; MFG_PN01: RC-01W5602FT; PCB Footprint: R0201; Value: 56K; Part Type: Í¨ÓÃºñÄ¤µç×è; Manufacturer PN: RC0402FR-0743KL; Created by: YTL
R3002 = RESISTOR: 0402,0Ohm,+/-1%; Part Reference: R3002; Manufacturer: YAGEO; MFG_NAME01: FENGHUA; RK PN: RC0402JR-07100KL; Priority: A; Wattage: 1/16W; MFG_PN01: RC-02000FT; PCB Footprint: R0402; Value: 0R; Part Type: Í¨ÓÃºñÄ¤µç×è; Manufacturer PN: RC0402JR-07100KL; Created by: YTL
TP917 = TESTLOOP: no part to order; Part Reference: TP917; CLASS: IO; ASSY_OPT: DNP; CAD_APPROVED: Yes; MFG_PN01: NOT A COMPONENT; HEIGHT: 0.1MM; ROHS: Yes; MFG_NAME01: NOT A COMPONENT; PCB Footprint: tpad_1212
TP918 = TESTLOOP: no part to order; Part Reference: TP918; CLASS: IO; ASSY_OPT: DNP; CAD_APPROVED: Yes; MFG_PN01: NOT A COMPONENT; HEIGHT: 0.1MM; ROHS: Yes; MFG_NAME01: NOT A COMPONENT; PCB Footprint: tpad_1212
TP919 = TESTLOOP: no part to order; Part Reference: TP919; CLASS: IO; ASSY_OPT: DNP; MFG_NAME01: NOT A COMPONENT; CAD_APPROVED: Yes; MFG_PN01: NOT A COMPONENT; ROHS: Yes; HEIGHT: 0.1MM; PCB Footprint: tpad_1212
TP1023 = T POINT R: no part to order; Part Reference: TP1023; ASSY_OPT: DNP; CLASS: IC; CAD_APPROVED: Yes; MFG_NAME01: NOT A COMPONENT; HEIGHT: 0.1MM; ROHS: Yes; MFG_PN01: NOT A COMPONENT; PCB Footprint: tpad_020
TP1037 = T POINT R: no part to order; Part Reference: TP1037; ASSY_OPT: DNP; CLASS: IC; CAD_APPROVED: Yes; MFG_NAME01: NOT A COMPONENT; HEIGHT: 0.1MM; ROHS: Yes; MFG_PN01: NOT A COMPONENT; PCB Footprint: tpad_020
TP1038 = T POINT R: no part to order; Part Reference: TP1038; ASSY_OPT: DNP; CLASS: IC; CAD_APPROVED: Yes; MFG_NAME01: NOT A COMPONENT; HEIGHT: 0.1MM; ROHS: Yes; MFG_PN01: NOT A COMPONENT; PCB Footprint: tpad_020
TP1039 = T POINT R: no part to order; Part Reference: TP1039; ASSY_OPT: DNP; CLASS: IC; CAD_APPROVED: Yes; MFG_NAME01: NOT A COMPONENT; HEIGHT: 0.1MM; ROHS: Yes; MFG_PN01: NOT A COMPONENT; PCB Footprint: tpad_020
TP1040 = T POINT R: no part to order; Part Reference: TP1040; ASSY_OPT: DNP; CLASS: IC; CAD_APPROVED: Yes; MFG_NAME01: NOT A COMPONENT; HEIGHT: 0.1MM; ROHS: Yes; MFG_PN01: NOT A COMPONENT; PCB Footprint: tpad_020
TP1041 = T POINT R: no part to order; Part Reference: TP1041; ASSY_OPT: DNP; CLASS: IC; CAD_APPROVED: Yes; MFG_NAME01: NOT A COMPONENT; HEIGHT: 0.1MM; ROHS: Yes; MFG_PN01: NOT A COMPONENT; PCB Footprint: tpad_020
U702 = MP8759_6: Part Reference: U702; MFG_NAME01: MPS; Value: MP8759; MFG_PN01: MP8759; PCB Footprint: qfn12_0p5_3p1x2p1
U703 = FDS4435: FDS4435BZ,SO-8,PMOS; Part Reference: U703; MFG_NAME01: onsemi; Value: FDS4435; MFG_PN01: FDS4435BZ; PCB Footprint: SOP8_1_27
U746 = MBR0540_1: MBR0540,SOD123; Part Reference: U746; MFG_NAME01: Cystek; Value: MBR0540; MFG_PN01: MBR0540; PCB Footprint: SOD_123
U747 = MBR0540_2: MBR0540,SOD123; Part Reference: U747; MFG_NAME01: Cystek; Value: MBR0540; MFG_PN01: MBR0540; PCB Footprint: SOD_123